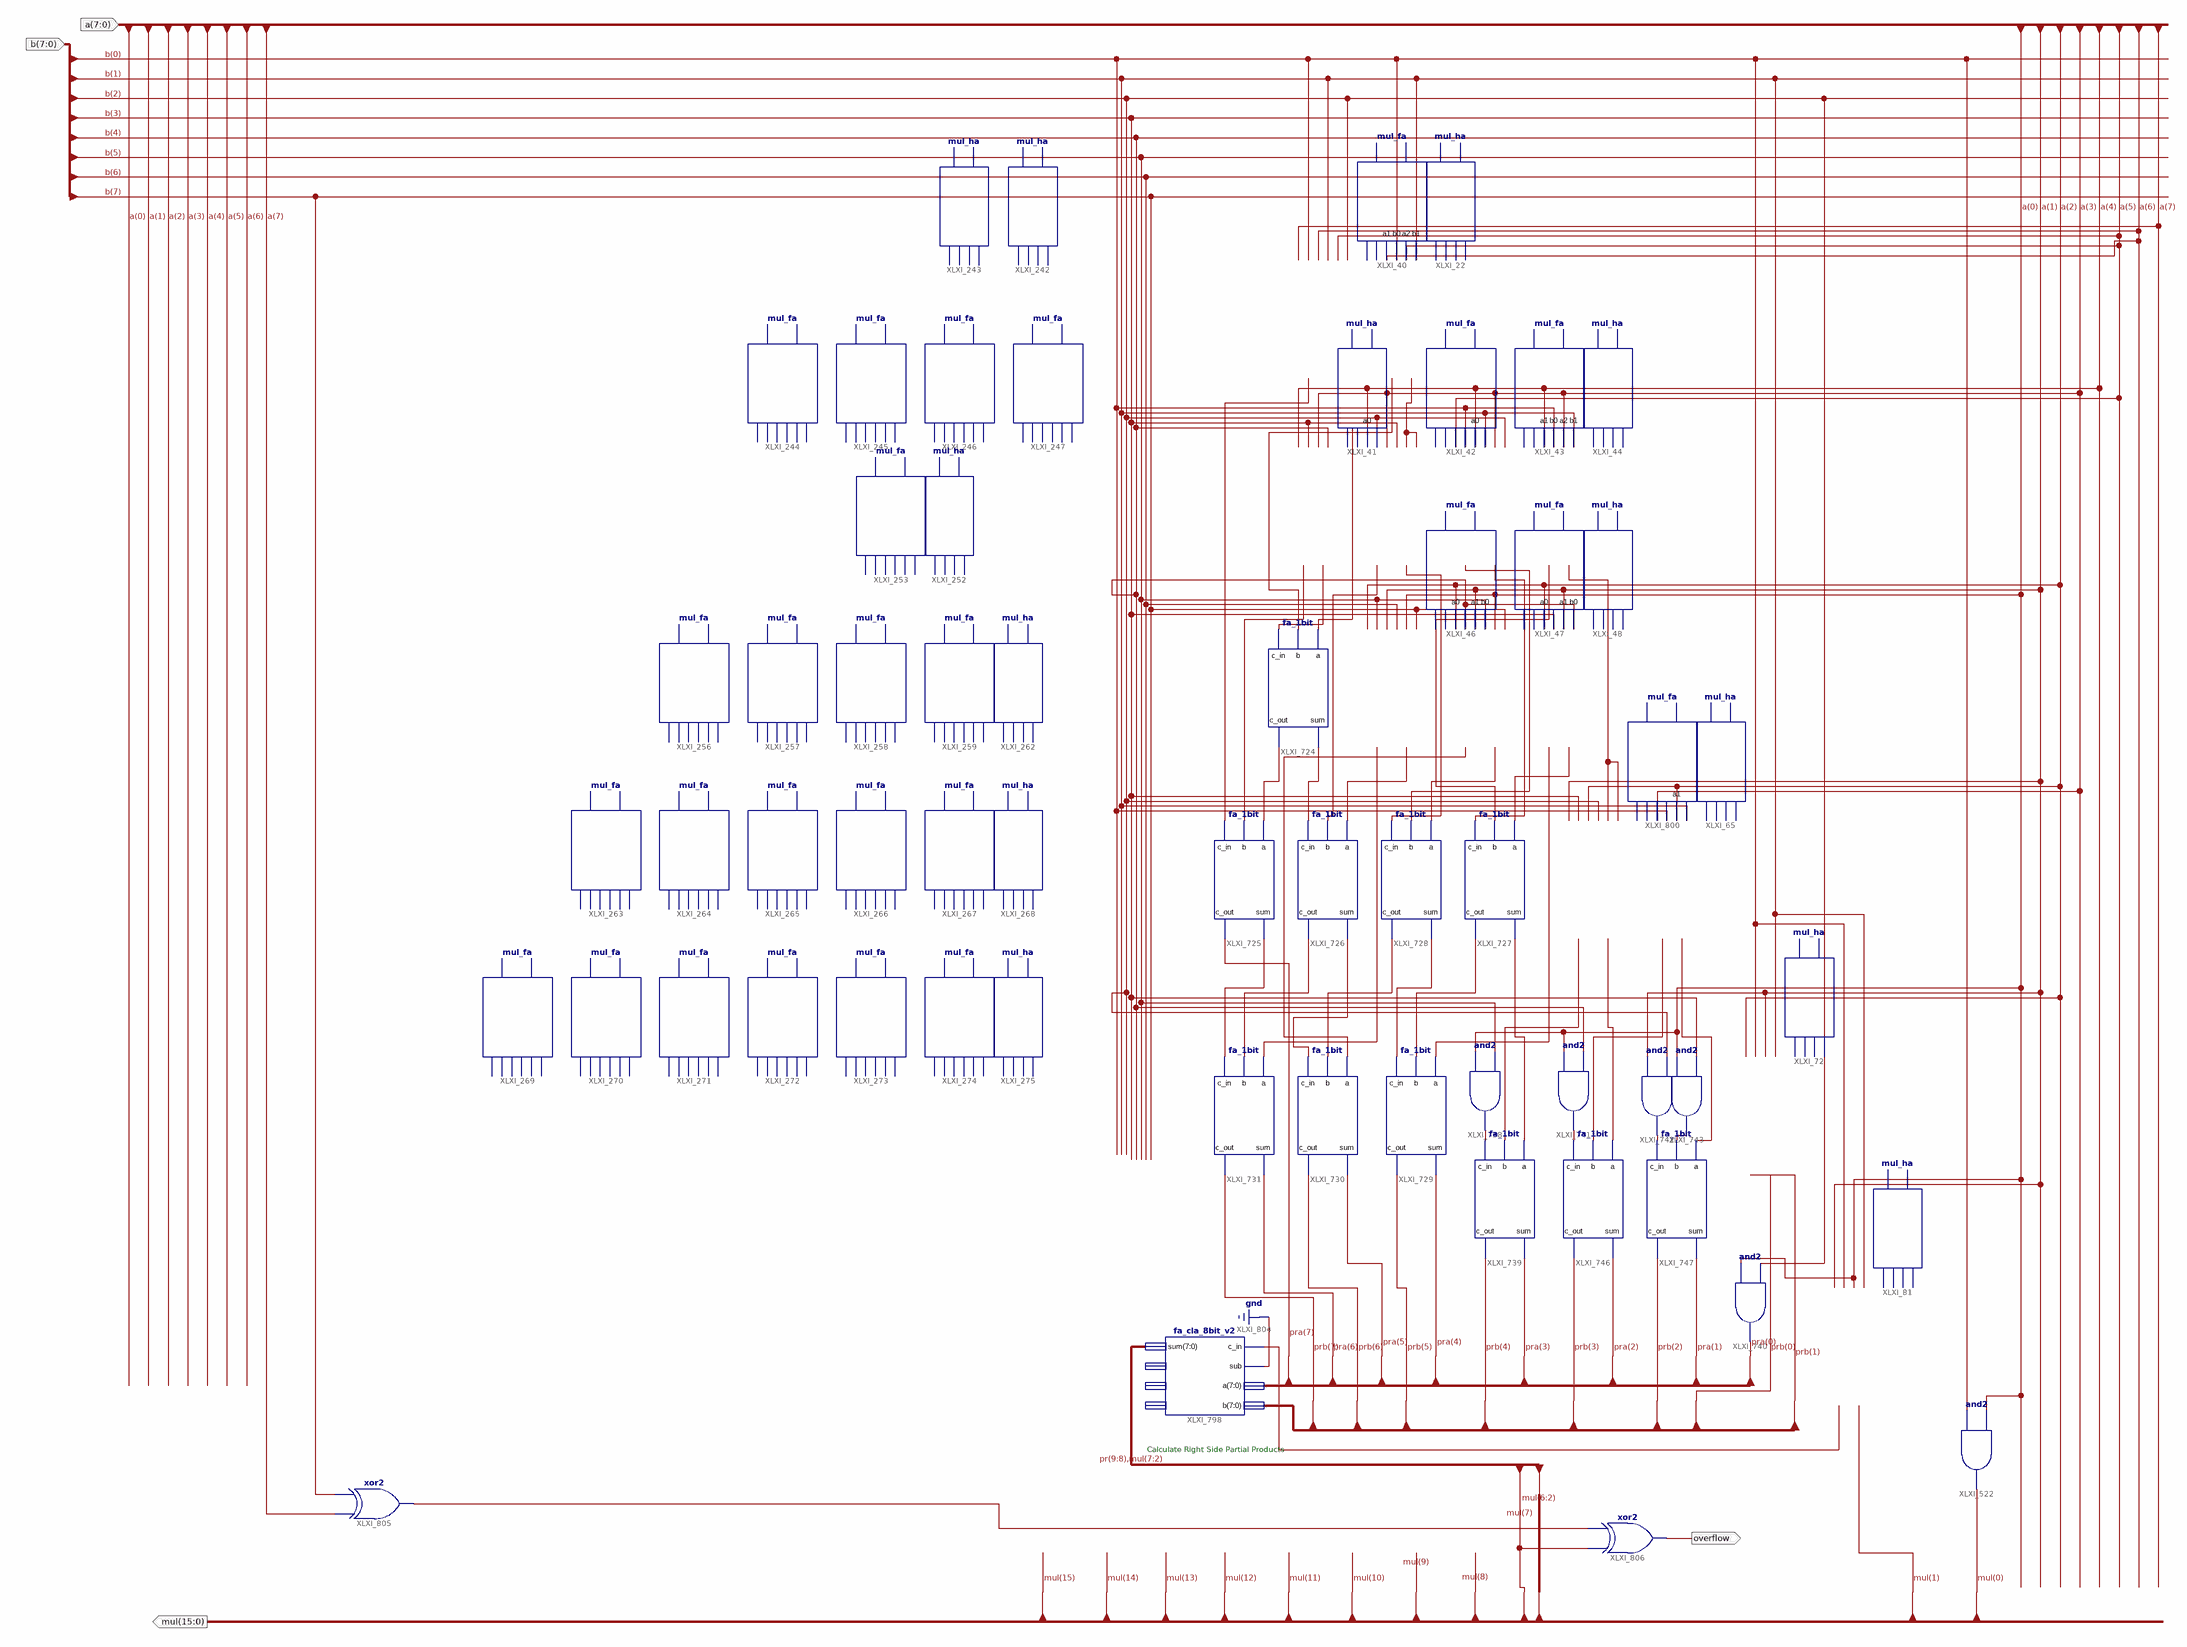
[diagram p0: schematic sheet 1]
// Xilinx ISE schematic mul_dadda.sch (spartan3e) as structural Verilog: 59 symbols, 4 ports
module mul_dadda (
  input  [7:0] b,
  input  [7:0] a,
  output [15:0] mul,
  output overflow
);

  wire XLXN_250, XLXN_251, XLXN_252, XLXN_253, XLXN_268, XLXN_291, XLXN_292, XLXN_293, XLXN_294, XLXN_296,
       XLXN_297, XLXN_298, XLXN_299, XLXN_300, XLXN_301, XLXN_302, XLXN_303, XLXN_304, XLXN_305, XLXN_306,
       XLXN_308, XLXN_309, XLXN_310, XLXN_311, XLXN_312, XLXN_313, XLXN_314, XLXN_315, XLXN_316, XLXN_317,
       XLXN_318, XLXN_319, XLXN_320, XLXN_321, XLXN_322, XLXN_323, XLXN_324;
  wire [7:0] pra, prb;
  wire [9:8] pr;

  mul_fa XLXI_256 ();  // open: a0, b0, a1, b1, a2, b2, C, S
  mul_fa XLXI_257 ();  // open: a0, b0, a1, b1, a2, b2, C, S
  mul_fa XLXI_258 ();  // open: a0, b0, a1, b1, a2, b2, C, S
  mul_fa XLXI_259 ();  // open: a0, b0, a1, b1, a2, b2, C, S
  mul_ha XLXI_252 ();  // open: a0, b0, a1, b1, C, S
  mul_fa XLXI_253 ();  // open: a0, b0, a1, b1, a2, b2, C, S
  mul_ha XLXI_262 ();  // open: a0, b0, a1, b1, C, S
  mul_fa XLXI_263 ();  // open: a0, b0, a1, b1, a2, b2, C, S
  mul_fa XLXI_264 ();  // open: a0, b0, a1, b1, a2, b2, C, S
  mul_fa XLXI_265 ();  // open: a0, b0, a1, b1, a2, b2, C, S
  mul_fa XLXI_266 ();  // open: a0, b0, a1, b1, a2, b2, C, S
  mul_fa XLXI_267 ();  // open: a0, b0, a1, b1, a2, b2, C, S
  mul_ha XLXI_268 ();  // open: a0, b0, a1, b1, C, S
  mul_fa XLXI_269 ();  // open: a0, b0, a1, b1, a2, b2, C, S
  mul_fa XLXI_270 ();  // open: a0, b0, a1, b1, a2, b2, C, S
  mul_fa XLXI_271 ();  // open: a0, b0, a1, b1, a2, b2, C, S
  mul_fa XLXI_272 ();  // open: a0, b0, a1, b1, a2, b2, C, S
  mul_fa XLXI_273 ();  // open: a0, b0, a1, b1, a2, b2, C, S
  mul_fa XLXI_274 ();  // open: a0, b0, a1, b1, a2, b2, C, S
  mul_ha XLXI_275 ();  // open: a0, b0, a1, b1, C, S
  and XLXI_522 (mul[0], b[0], a[0]);
  mul_ha XLXI_22 (.a0(a[6]), .b0(b[0]), .a1(a[5]), .b1(b[1]), .C(XLXN_294), .S(XLXN_296));
  mul_fa XLXI_40 (.a0(a[7]), .b0(b[0]), .a1(a[6]), .b1(b[1]), .a2(a[5]), .b2(b[2]), .C(XLXN_291), .S(XLXN_297));
  mul_ha XLXI_41 (.a0(a[4]), .b0(b[3]), .a1(a[3]), .b1(b[4]), .C(XLXN_292), .S(XLXN_293));
  mul_fa XLXI_42 (.a0(a[4]), .b0(b[2]), .a1(a[3]), .b1(b[3]), .a2(XLXN_296), .b2(XLXN_296), .C(XLXN_298), .S(XLXN_303));
  mul_fa XLXI_43 (.a0(a[5]), .b0(b[0]), .a1(a[4]), .b1(b[1]), .a2(a[3]), .b2(b[2]), .C(XLXN_304), .S(XLXN_305));
  mul_ha XLXI_44 (.a0(a[4]), .b0(b[0]), .a1(a[3]), .b1(b[1]), .C(XLXN_306), .S(XLXN_308));
  mul_fa XLXI_247 ();  // open: a0, b0, a1, b1, a2, b2, C, S
  mul_fa XLXI_246 ();  // open: a0, b0, a1, b1, a2, b2, C, S
  mul_fa XLXI_245 ();  // open: a0, b0, a1, b1, a2, b2, C, S
  mul_fa XLXI_244 ();  // open: a0, b0, a1, b1, a2, b2, C, S
  mul_ha XLXI_48 (.a0(a[2]), .b0(b[3]), .a1(a[1]), .b1(b[4]), .C(XLXN_321), .S(XLXN_322));
  mul_fa XLXI_47 (.a0(a[2]), .b0(b[4]), .a1(a[1]), .b1(b[5]), .a2(a[0]), .b2(b[7]), .C(XLXN_310), .S(XLXN_302));
  mul_fa XLXI_46 (.a0(a[2]), .b0(b[5]), .a1(a[1]), .b1(b[6]), .a2(a[0]), .b2(b[7]), .C(XLXN_309), .S(XLXN_301));
  mul_ha XLXI_65 (.a0(a[3]), .b0(b[0]), .a1(a[2]), .b1(b[1]), .C(XLXN_315), .S(XLXN_320));
  mul_ha XLXI_242 ();  // open: a0, b0, a1, b1, C, S
  mul_ha XLXI_243 ();  // open: a0, b0, a1, b1, C, S
  fa_1bit XLXI_724 (.a(XLXN_297), .b(XLXN_294), .c_in(XLXN_293), .sum(XLXN_299), .c_out(XLXN_300));
  fa_1bit XLXI_725 (.a(XLXN_300), .b(XLXN_292), .c_in(XLXN_291), .sum(XLXN_316), .c_out(pra[7]));
  fa_1bit XLXI_726 (.a(XLXN_301), .b(XLXN_298), .c_in(XLXN_299), .sum(XLXN_323), .c_out(XLXN_312));
  fa_1bit XLXI_727 (.a(XLXN_322), .b(XLXN_306), .c_in(XLXN_305), .sum(XLXN_318), .c_out(XLXN_313));
  fa_1bit XLXI_728 (.a(XLXN_302), .b(XLXN_304), .c_in(XLXN_303), .sum(XLXN_317), .c_out(XLXN_311));
  mul_ha XLXI_81 (.a0(a[1]), .b0(b[0]), .a1(a[0]), .b1(b[1]), .C(XLXN_268), .S(mul[1]));
  and XLXI_740 (pra[0], a[0], b[2]);
  mul_ha XLXI_72 (.a0(a[2]), .b0(b[0]), .a1(a[1]), .b1(b[1]), .C(prb[1]), .S(prb[0]));
  fa_1bit XLXI_747 (.a(XLXN_320), .b(XLXN_253), .c_in(XLXN_252), .sum(pra[1]), .c_out(prb[2]));
  and XLXI_742 (XLXN_252, a[1], b[2]);
  fa_1bit XLXI_746 (.a(XLXN_319), .b(XLXN_315), .c_in(XLXN_251), .sum(pra[2]), .c_out(prb[3]));
  and XLXI_741 (XLXN_251, a[0], b[4]);
  fa_1bit XLXI_739 (.a(XLXN_318), .b(XLXN_314), .c_in(XLXN_250), .sum(pra[3]), .c_out(prb[4]));
  and XLXI_738 (XLXN_250, a[0], b[5]);
  fa_1bit XLXI_729 (.a(XLXN_321), .b(XLXN_313), .c_in(XLXN_317), .sum(pra[4]), .c_out(prb[5]));
  fa_1bit XLXI_730 (.a(XLXN_310), .b(XLXN_311), .c_in(XLXN_323), .sum(pra[5]), .c_out(prb[6]));
  fa_1bit XLXI_731 (.a(XLXN_309), .b(XLXN_312), .c_in(XLXN_316), .sum(pra[6]), .c_out(prb[7]));
  and XLXI_743 (XLXN_253, a[0], b[3]);
  mul_fa XLXI_800 (
    .a0(a[1]), .b0(b[3]), .a1(a[2]), .b1(b[2]), .a2(XLXN_308), .b2(XLXN_308), .C(XLXN_314), .S(XLXN_319));
  fa_cla_8bit_v2 XLXI_798 (.b(prb), .a(pra), .sub(1'b0), .c_in(XLXN_268), .sum({pr, mul[7:2]}));  // open: c_out, p, g
  xor XLXI_805 (XLXN_324, a[7], b[7]);
  xor XLXI_806 (overflow, mul[7], XLXN_324);

  // Notes on the sheet:
  //   Calculate Right Side Partial Products
endmodule
